# Altium schematic sheet 09sata.SchDoc
size A
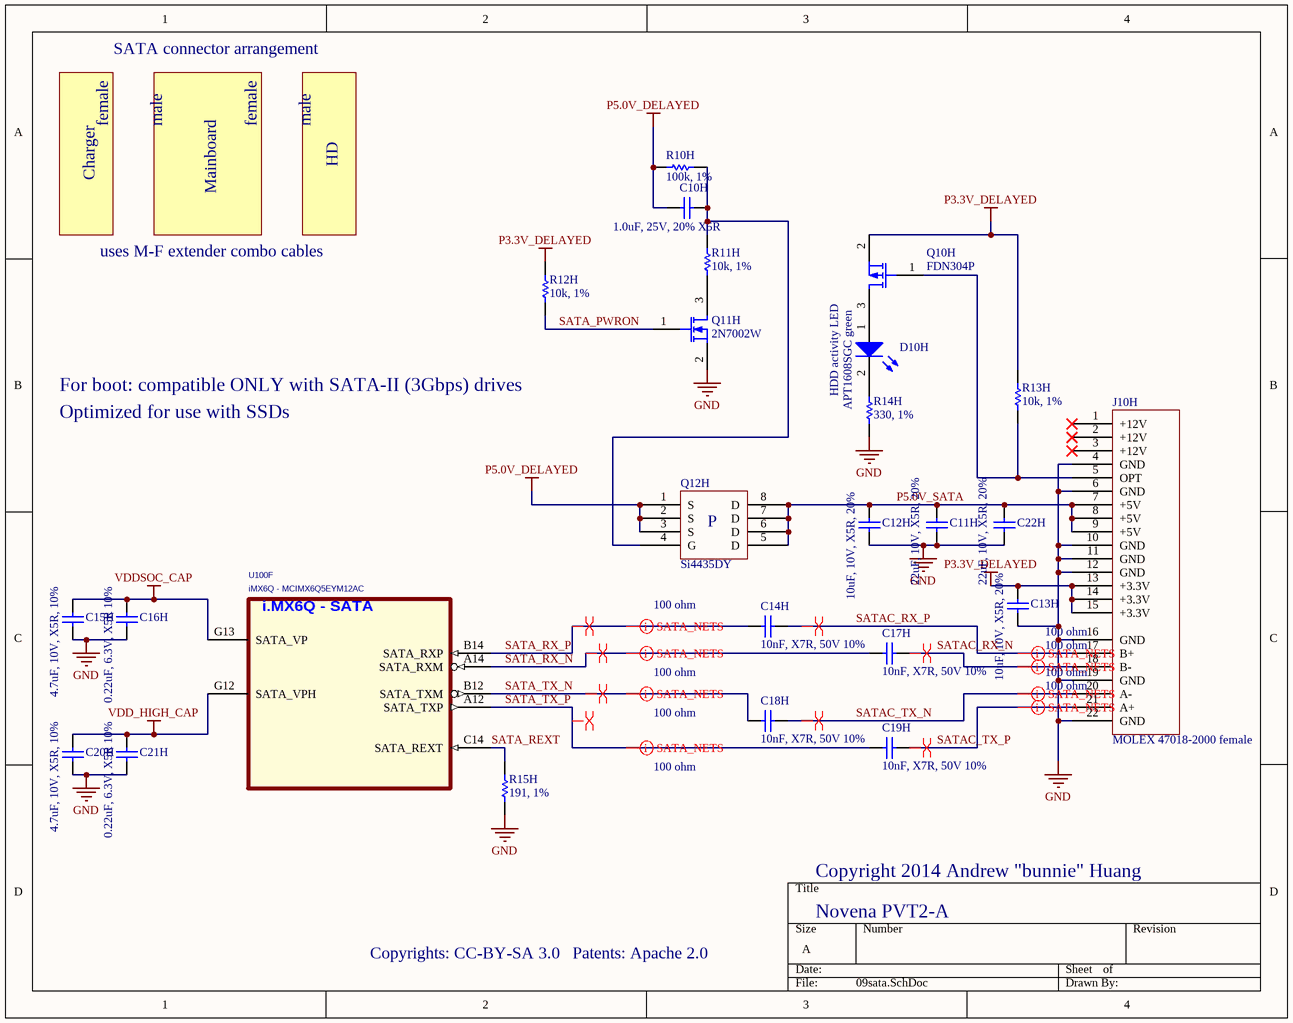
[diagram p0: 09sata.SchDoc]

## Parts
C10H  1.0uF, 25V, 20% X5R  [CAPC1608N]
C11H  22uF, 10V, X5R, 20%  [CAPC2012N]
C12H  10uF, 10V, X5R, 20%  [CAPC1608N]
C13H  10uF, 10V, X5R, 20%  [CAPC1608N]
C14H  10nF, X7R, 50V 10%  [CAPC1005N]
C15H  4.7uF, 10V, X5R, 10%  [CAPC1608N_HD]
C16H  0.22uF, 6.3V, X5R 10%  [CAPC0603N_B]
C17H  10nF, X7R, 50V 10%  [CAPC1005N]
C18H  10nF, X7R, 50V 10%  [CAPC1005N]
C19H  10nF, X7R, 50V 10%  [CAPC1005N]
C20H  4.7uF, 10V, X5R, 10%  [CAPC1608N_HD]
C21H  0.22uF, 6.3V, X5R 10%  [CAPC0603N_B]
C22H  22uF, 10V, X5R, 20%  [CAPC2012N]
D10H  APT1608SGC green  [CD1608-0603]
J10H  MOLEX 47018-2000 female  [SATA_MOLEX_47018_2000]
Q10H  FDN304P  [SOT23-3N]
Q11H  2N7002W  [SOT323-3AN]
Q12H  Si4435DY  [SOIC127P600-8AN]
R10H  100k, 1%  [RESC1005N]
R11H  10k, 1%  [RESC1005N]
R12H  10k, 1%  [RESC1005N]
R13H  10k, 1%  [RESC1005N]
R14H  330, 1%  [RESC1005N]
R15H  191, 1%  [RESC1005N]
U100  iMX6Q - MCIMX6Q5EYM12AC  [FREESCALE_BGA624C80P25X25_2100X2100X216]  (part F of 12)

## Nets
GND: C11H.2 C12H.2 C13H.2 C15H.2 C16H.2 C20H.2 C21H.2 C22H.2 J10H.4(GND) J10H.6(GND) J10H.10(GND) J10H.11(GND) J10H.12(GND) J10H.16(GND) J10H.19(GND) J10H.22(GND) Q11H.2(S) R14H.1 R15H.2
P3.3V_DELAYED: C13H.1 J10H.13(+3.3V) J10H.14(+3.3V) J10H.15(+3.3V) Q10H.2(S) R12H.1 R13H.1
P5.0V_DELAYED: C10H.1 Q12H.1(S) Q12H.2(S) Q12H.3(S) R10H.2
VDD_HIGH_CAP: C20H.1 C21H.1 U100.G12(SATA_VPH)
VDDSOC_CAP: C15H.1 C16H.1 U100.G13(SATA_VP)
P5.0V_SATA: C11H.1 C12H.1 C22H.1 J10H.7(+5V) J10H.8(+5V) J10H.9(+5V) Q12H.5(D) Q12H.6(D) Q12H.7(D) Q12H.8(D)
SATA_PWRON: Q11H.1(G) R12H.2
SATA_REXT: R15H.1 U100.C14(SATA_REXT)
SATA_RX_N: C17H.1 U100.A14(SATA_RXM)
SATA_RX_P: C14H.1 U100.B14(SATA_RXP)
SATA_TX_N: C18H.1 U100.B12(SATA_TXM)
SATA_TX_P: C19H.1 U100.A12(SATA_TXP)
SATAC_RX_N: C17H.2 J10H.18(B-)
SATAC_RX_P: C14H.2 J10H.17(B+)
SATAC_TX_N: C18H.2 J10H.20(A-)
SATAC_TX_P: C19H.2 J10H.21(A+)
NetC10H_2: C10H.2 Q12H.4(G) R10H.1 R11H.1
NetD10H_1: D10H.1(A) Q10H.3(D)
NetD10H_2: D10H.2(K) R14H.2
NetJ10H_5: J10H.5(OPT) Q10H.1(G) R13H.2
NetQ11H_3: Q11H.3(D) R11H.2

Not connected (* = marked no-connect by the designer): J10H 1(+12V)* 2(+12V)* 3(+12V)*

## Layout directives
differential pair: SATA_RX_N, SATA_RX_P, SATA_TX_N, SATA_TX_P, SATAC_RX_N, SATAC_RX_P, SATAC_TX_N, SATAC_TX_P
net class SATA_NETS; Impedance: 100 ohm: SATA_RX_N, SATA_RX_P, SATA_TX_N, SATA_TX_P, SATAC_RX_N, SATAC_RX_P, SATAC_TX_N, SATAC_TX_P

## Notes on the sheet
- SATA connector arrangement
- female
- male
- HD
- Charger
- Mainboard
- uses M-F extender combo cables
- For boot: compatible ONLY with SATA-II (3Gbps) drives
- Optimized for use with SSDs
- HDD activity LED
- Copyright 2014 Andrew "bunnie" Huang
- Copyrights: CC-BY-SA 3.0
- Patents: Apache 2.0
- Novena PVT2-A
- (in symbol PCIMX6Q6VV1A, part F) i.MX6Q - SATA
- (in symbol Si4435DY) P

## Library data of the parts
C10H C11H C12H C13H C14H C15H C17H C18H C19H C20H C22H = Cap Semi: Capacitor (Semiconductor SIM Model); Published: 8-Jun-2000; LatestRevisionDate: 17-Jul-2002; LatestRevisionNote: Re-released for DXP Platform.; PackageReference: C1206; Publisher: Altium Limited
C16H C21H = Cap Semi: CAP CER 0.22UF 6.3V 20% X5R 0201; Published: 8-Jun-2000; LatestRevisionDate: 17-Jul-2002; LatestRevisionNote: Re-released for DXP Platform.; PackageReference: C1206; Publisher: Altium Limited
D10H = LED2: Typical RED, GREEN, YELLOW, AMBER GaAs LED; Published: 8-Jun-2000; LatestRevisionDate: 17-Jul-2002; LatestRevisionNote: Re-released for DXP Platform.; PackageVersion: Feb-2002; PackageReference: 3.2X1.6X1.1; Publisher: Altium Limited
J10H = SATA_22P_HEADER: SATA+Power connector
Q10H = MOSFET-P: P-Channel MOSFET; Published: 8-Jun-2000; LatestRevisionDate: 17-Jul-2002; LatestRevisionNote: Re-released for DXP Platform.; PackageVersion: 1995/1996; PackageReference: E3; Publisher: Altium Limited; PackageDescription: TO, Flat Index; 3 In-Line, Axial Leads; Body Dia. 4.6mm; Lead Dia. 0.5 mm (max)
Q11H = MOSFET-N: N-Channel MOSFET; Published: 8-Jun-2000; LatestRevisionDate: 17-Jul-2002; LatestRevisionNote: Re-released for DXP Platform.; PackageVersion: 1995/1996; PackageReference: E3; Publisher: Altium Limited
Q12H = Si4435DY: Singre P-channel FET, 8A, 30V
R10H = Res1: Resistor; Published: 8-Jun-2000; LatestRevisionDate: 17-Jul-2002; LatestRevisionNote: Re-released for DXP Platform.; PackageReference: AXIAL-0.3; Publisher: Altium Limited; Value: 100k
R11H R12H R13H R14H R15H = Res1: Resistor; Value: 100k; Published: 8-Jun-2000; LatestRevisionDate: 17-Jul-2002; LatestRevisionNote: Re-released for DXP Platform.; PackageReference: AXIAL-0.3; Publisher: Altium Limited
U100 = PCIMX6Q6VV1A: PCIMX6Q5EVT10AC; AGILE_PN: TMP-WF-14526; MFG_NAME01: Freescale Semiconductor; PRE_APN: 344-01218; MFG_PN01: PCIMX6Q6VV1A; ROHS: Yes; HEIGHT: 2.16MM